# Altium schematic sheet Synthdude.SchDoc
size A; SheetNumber: 1; SheetTotal: 7
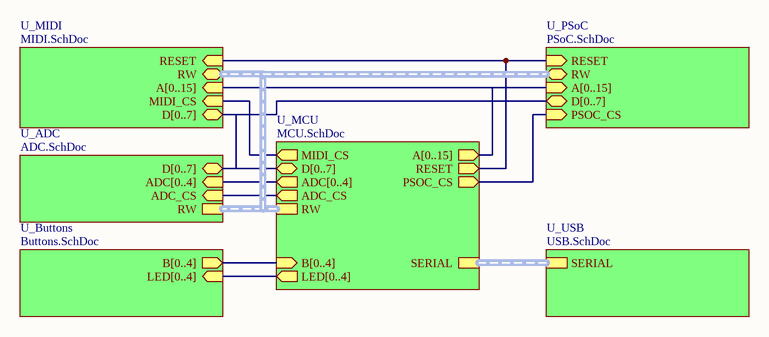
[diagram p0: Synthdude.SchDoc]

## Sub-sheets
U_ADC = ADC.SchDoc: D[0..7] (bidir), ADC[0..4] (in), RW (harness RW), ADC_CS (in)
U_Buttons = Buttons.SchDoc: B[0..4] (out), LED[0..4] (in)
U_MCU = MCU.SchDoc: D[0..7] (bidir), A[0..15] (out), SERIAL (harness UART), ADC_CS (out), MIDI_CS (out), PSOC_CS (out), RW (harness RW), ADC[0..4] (out), RESET (out), B[0..4] (in), LED[0..4] (out)
U_MIDI = MIDI.SchDoc: D[0..7] (bidir), MIDI_CS (in), A[0..15] (in), RESET (in), RW (harness RW)
U_PSoC = PSoC.SchDoc: D[0..7] (bidir), PSOC_CS (in), RESET (in), A[0..15] (in), RW (harness RW)
U_USB = USB.SchDoc: SERIAL (harness UART)

## Nets
(unnamed): sheet U_MCU/ADC_CS, sheet U_ADC/ADC_CS
(unnamed): sheet U_MCU/MIDI_CS, sheet U_MIDI/MIDI_CS
(unnamed): sheet U_MCU/PSOC_CS, sheet U_PSoC/PSOC_CS
(unnamed): sheet U_MCU/RESET, sheet U_MIDI/RESET, sheet U_PSoC/RESET

## Buses and harness runs
bus sheet U_ADC/ADC[0..4] = sheet U_MCU/ADC[0..4]
bus sheet U_ADC/D[0..7] = sheet U_MCU/D[0..7] = sheet U_MIDI/D[0..7] = sheet U_PSoC/D[0..7]
bus sheet U_Buttons/B[0..4] = sheet U_MCU/B[0..4]
bus sheet U_Buttons/LED[0..4] = sheet U_MCU/LED[0..4]
bus sheet U_MCU/A[0..15] = sheet U_MIDI/A[0..15] = sheet U_PSoC/A[0..15]
harness sheet U_ADC/RW = sheet U_MCU/RW = sheet U_MIDI/RW = sheet U_PSoC/RW
harness sheet U_MCU/SERIAL = sheet U_USB/SERIAL